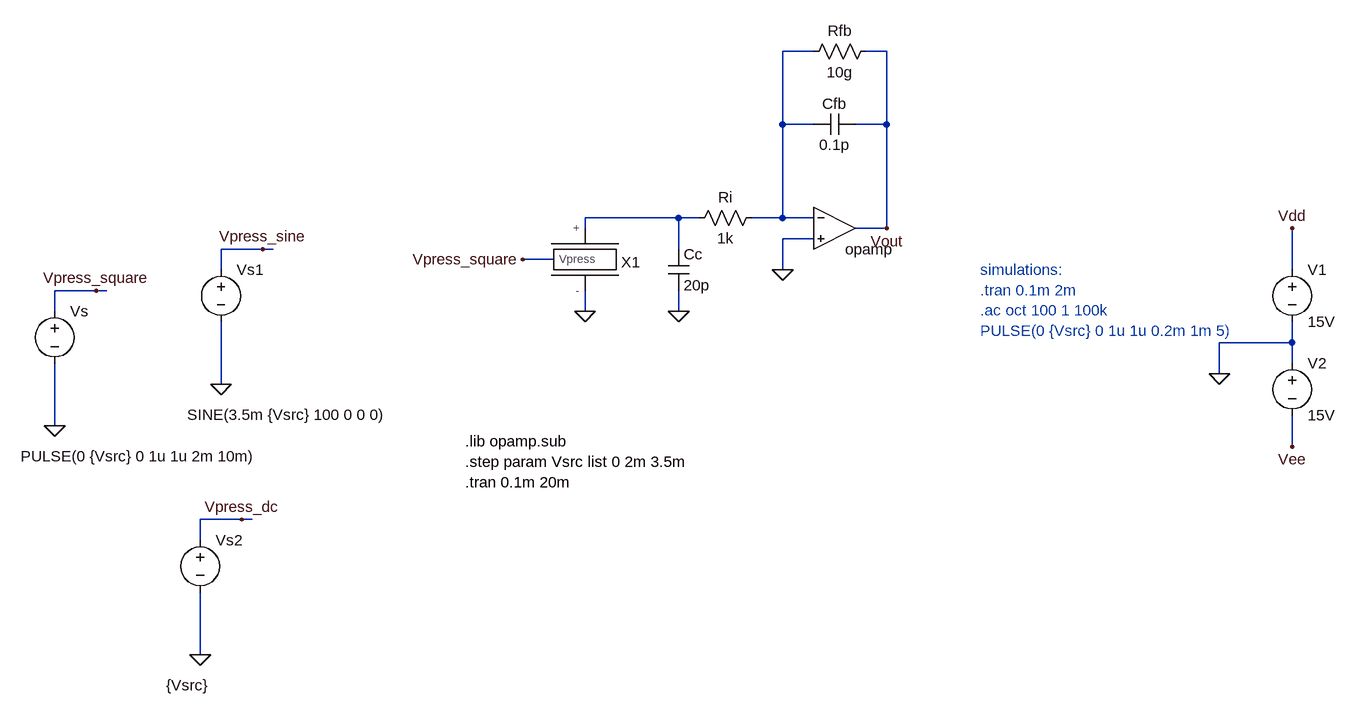
[diagram p0: schematic ChargeAmplifier2.asc]
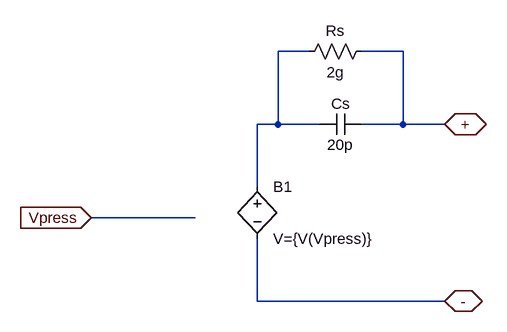
[diagram p1: sub-circuit sensor_pze_simple.asc]
ChargeAmplifier2.asc, the LTspice schematic file:
Version 4
SHEET 1 1256 892
WIRE 448 -96 400 -96
WIRE 560 -96 528 -96
WIRE 400 16 400 -96
WIRE 448 16 400 16
WIRE 560 16 560 -96
WIRE 560 16 512 16
WIRE 240 160 96 160
WIRE 272 160 240 160
WIRE 400 160 400 16
WIRE 400 160 352 160
WIRE 448 160 400 160
WIRE 96 176 96 160
WIRE 560 176 560 16
WIRE 560 176 512 176
WIRE 448 192 400 192
WIRE -400 208 -464 208
WIRE -384 208 -400 208
WIRE 240 208 240 160
WIRE 48 224 0 224
WIRE -464 240 -464 208
WIRE 400 240 400 192
WIRE 1184 240 1184 176
WIRE -656 272 -720 272
WIRE -640 272 -656 272
WIRE -720 304 -720 272
WIRE 96 304 96 272
WIRE 240 304 240 272
WIRE 1184 352 1184 320
WIRE 1184 352 1072 352
WIRE 1184 384 1184 352
WIRE 1072 400 1072 352
WIRE -464 416 -464 320
WIRE -720 480 -720 384
WIRE 1184 512 1184 464
WIRE -432 624 -496 624
WIRE -416 624 -432 624
WIRE -496 656 -496 624
WIRE -496 832 -496 736
FLAG 400 240 0
FLAG 560 176 Vout
FLAG 1072 400 0
FLAG 1184 176 Vdd
FLAG 1184 512 Vee
FLAG 240 304 0
FLAG -720 480 0
FLAG 96 304 0
FLAG 0 224 Vpress_square
FLAG -656 272 Vpress_square
FLAG -464 416 0
FLAG -400 208 Vpress_sine
FLAG -496 832 0
FLAG -432 624 Vpress_dc
SYMBOL cap 512 0 R90
WINDOW 0 0 32 VBottom 2
WINDOW 3 32 32 VTop 2
SYMATTR InstName Cfb
SYMATTR Value 0.1p
SYMBOL res 544 -112 R90
WINDOW 0 0 56 VBottom 2
WINDOW 3 32 56 VTop 2
SYMATTR InstName Rfb
SYMATTR Value 10g
SYMBOL res 368 144 R90
WINDOW 0 0 56 VBottom 2
WINDOW 3 32 56 VTop 2
SYMATTR InstName Ri
SYMATTR Value 1k
SYMBOL voltage 1184 224 R0
SYMATTR InstName V1
SYMATTR Value 15V
SYMBOL voltage 1184 368 R0
SYMATTR InstName V2
SYMATTR Value 15V
SYMBOL Opamps/opamp 480 112 R0
WINDOW 0 0 32 Invisible 2
SYMATTR InstName U1
SYMBOL cap 224 208 R0
SYMATTR InstName Cc
SYMATTR Value 20p
SYMBOL voltage -720 288 R0
WINDOW 3 -52 239 Left 2
SYMATTR Value PULSE(0 {Vsrc} 0 1u 1u 2m 10m)
SYMATTR InstName Vs
SYMATTR Value2 AC 1m
SYMBOL SENSOR_PZE_SIMPLE 96 224 R0
SYMATTR InstName X1
SYMBOL voltage -464 224 R0
WINDOW 3 -52 239 Left 2
SYMATTR Value SINE(3.5m {Vsrc} 100 0 0 0)
SYMATTR InstName Vs1
SYMATTR Value2 AC 1m
SYMBOL voltage -496 640 R0
WINDOW 3 -52 239 Left 2
SYMATTR Value {Vsrc}
SYMATTR InstName Vs2
SYMATTR Value2 AC 1m
TEXT -88 504 Left 2 !.lib opamp.sub\n.step param Vsrc list 0 2m 3.5m\n.tran 0.1m 20m
TEXT 704 240 Left 2 ;simulations:\n.tran 0.1m 2m\n.ac oct 100 1 100k\nPULSE(0 {Vsrc} 0 1u 1u 0.2m 1m 5)

sensor_pze_simple.asc, the sub-circuit schematic file:
Version 4
SHEET 1 960 940
WIRE -176 496 -224 496
WIRE -32 496 -96 496
WIRE -224 608 -224 496
WIRE -224 608 -256 608
WIRE -160 608 -224 608
WIRE -32 608 -32 496
WIRE -32 608 -96 608
WIRE 32 608 -32 608
WIRE -256 704 -256 608
WIRE -352 752 -512 752
WIRE -256 880 -256 784
WIRE 32 880 -256 880
FLAG -512 752 Vpress
IOPIN -512 752 In
FLAG 32 608 +
IOPIN 32 608 BiDir
FLAG 32 880 -
IOPIN 32 880 BiDir
SYMBOL cap -96 592 R90
WINDOW 0 0 32 VBottom 2
WINDOW 3 32 32 VTop 2
SYMATTR InstName Cs
SYMATTR Value 20p
SYMBOL res -80 480 R90
WINDOW 0 0 56 VBottom 2
WINDOW 3 32 56 VTop 2
SYMATTR InstName Rs
SYMATTR Value 2g
SYMBOL bv -256 688 R0
SYMATTR InstName B1
SYMATTR Value V={V(Vpress)}

The netlist it stands for:
* ChargeAmplifier2.asc
Cfb Vout N001 0.1p
Rfb Vout N001 10g
Ri N001 N002 1k
V1 Vdd 0 15V
V2 0 Vee 15V
XU1 N001 0 Vout opamp Aol=100K GBW=10Meg  ; pins invin noninvin out
Cc N002 0 20p
Vs Vpress_square 0 PULSE(0 {Vsrc} 0 1u 1u 2m 10m) AC 1m
XX1 Vpress_square N002 0 sensor_pze_simple
Vs1 Vpress_sine 0 SINE(3.5m {Vsrc} 100 0 0 0) AC 1m
Vs2 Vpress_dc 0 {Vsrc} AC 1m

* block symbol definitions
.subckt sensor_pze_simple Vpress + -
Cs + N001 20p
Rs + N001 2g
B1 N001 - V={V(Vpress)}
.ends sensor_pze_simple

.lib opamp.sub
.step param Vsrc list 0 2m 3.5m
.tran 0.1m 20m
* simulations:
* .tran 0.1m 2m
* .ac oct 100 1 100k
* PULSE(0 {Vsrc} 0 1u 1u 0.2m 1m 5)
.backanno
.end